# Altium schematic sheet S00-OVERVIEW.SchDoc
size B; SheetNumber: 1; SheetTotal: 7; BLOCK-TITLE: OVERVIEW AND TITLE PAGE; BLOCK-SIZE: B; BLOCK-PROJECT: MULTIMOD BASE; BLOCK-REVISION: 1; BLOCK-ORGANIZATION: UNIVERSITY OF FLORIDA; BLOCK-DESIGNER: MEHRON TALEBI; BLOCK-IDENTIFIER: SUMMER 2023; BLOCK-REVIEWER: MIKE STAPLETON
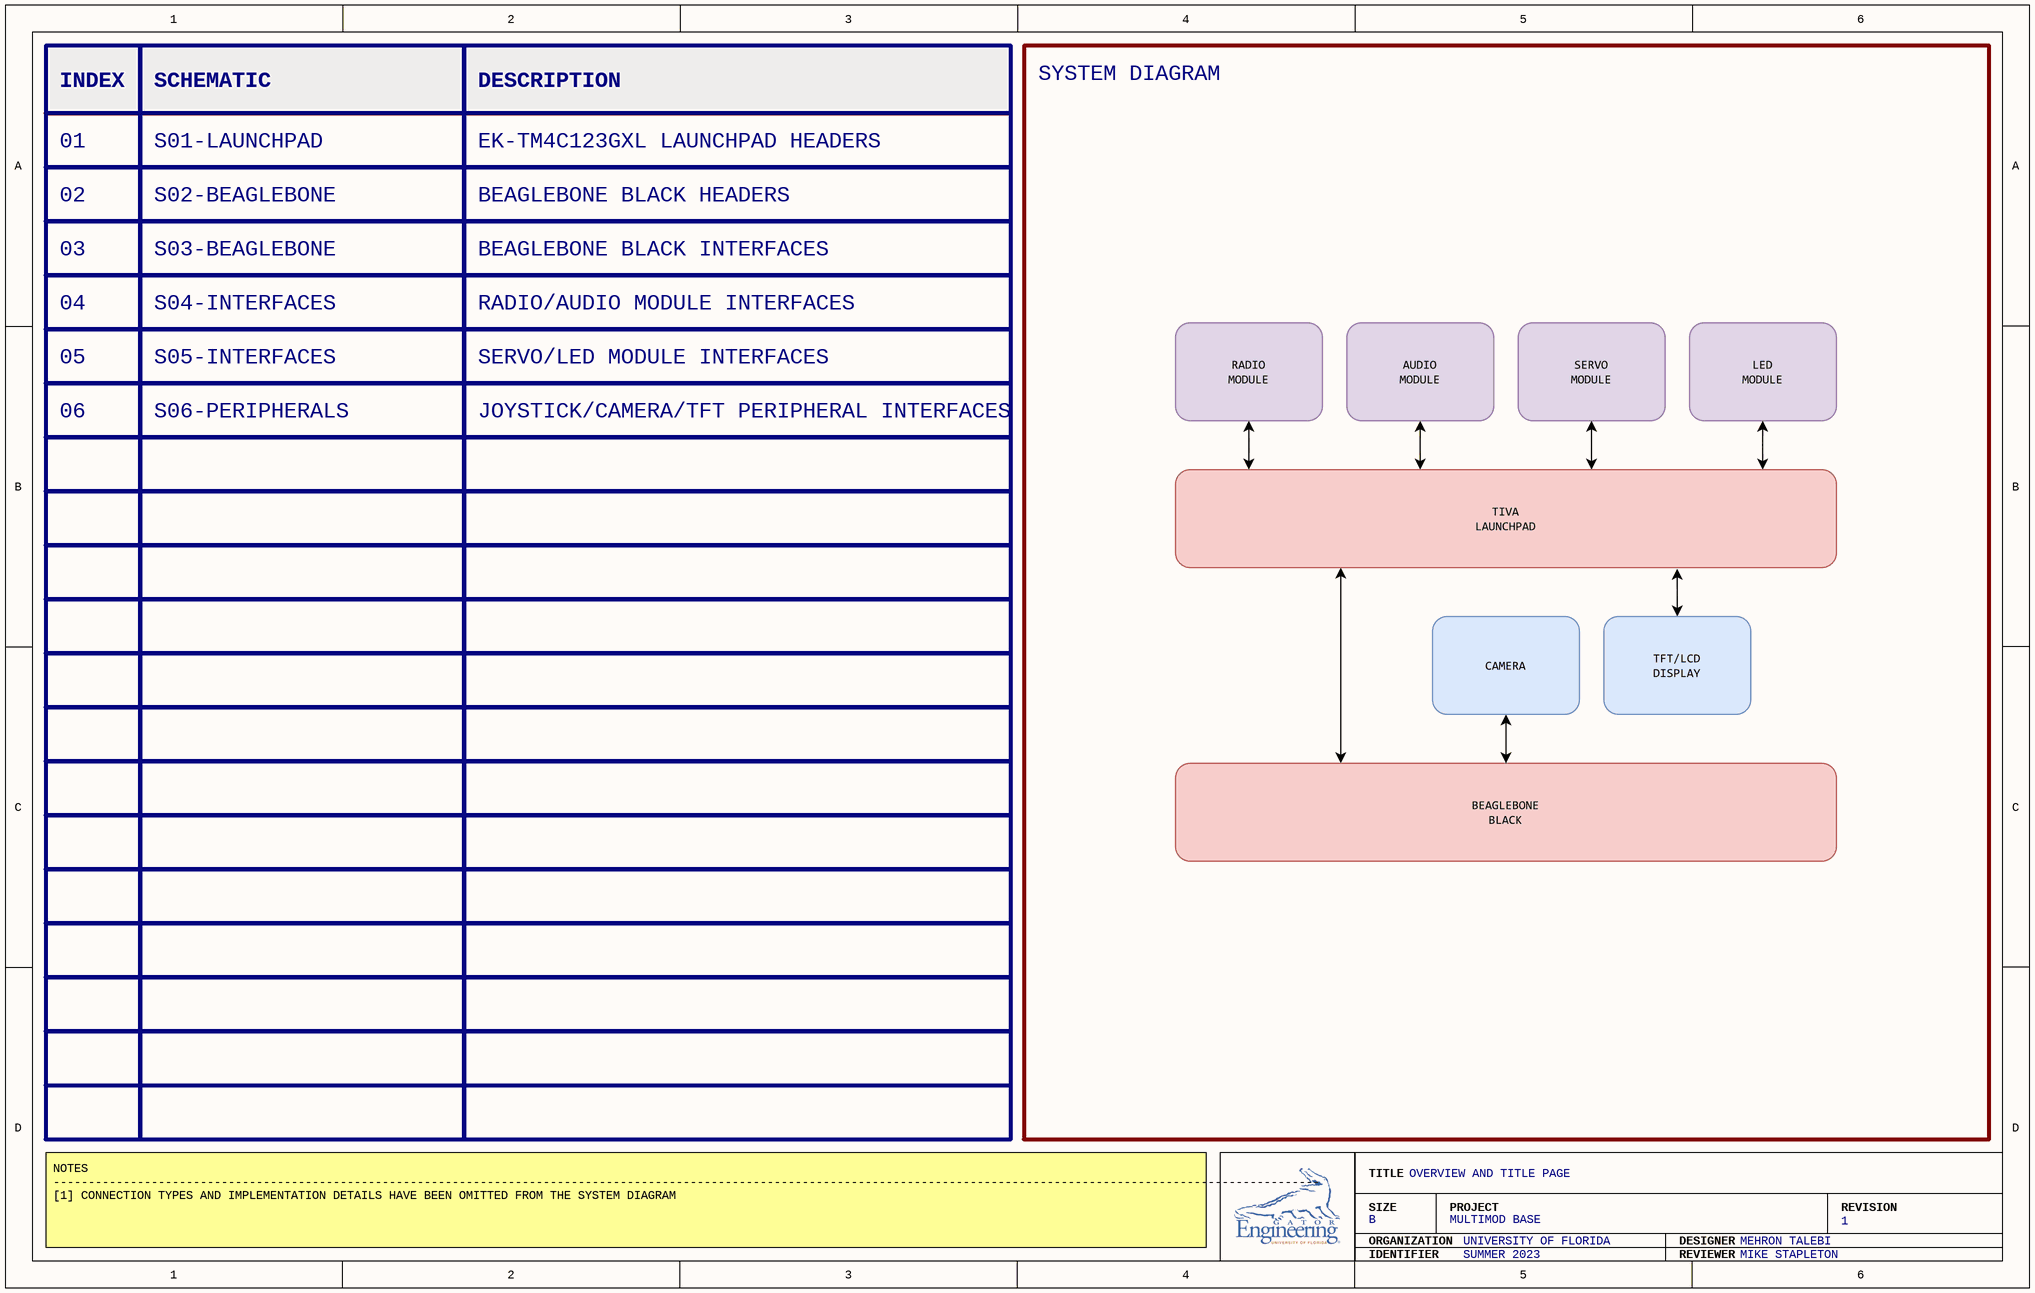
[diagram p0: S00-OVERVIEW.SchDoc]

## Notes on the sheet
- INDEX
- SCHEMATIC
- DESCRIPTION
- SYSTEM DIAGRAM
- 01
- S01-LAUNCHPAD
- EK-TM4C123GXL LAUNCHPAD HEADERS
- 02
- 03
- S02-BEAGLEBONE
- S03-BEAGLEBONE
- BEAGLEBONE BLACK INTERFACES
- BEAGLEBONE BLACK HEADERS
- 04
- S04-INTERFACES
- RADIO/AUDIO MODULE INTERFACES
- 05
- S05-INTERFACES
- SERVO/LED MODULE INTERFACES
- 06
- S06-PERIPHERALS
- JOYSTICK/CAMERA/TFT PERIPHERAL INTERFACES
- NOTES
  -------------------------------------------------------------------------------------------------------------------------------------------------------------------------------------
  [1] CONNECTION TYPES AND IMPLEMENTATION DETAILS HAVE BEEN OMITTED FROM THE SYSTEM DIAGRAM
- TITLE
- SIZE
- ORGANIZATION
- PROJECT
- DESIGNER
- REVISION
- IDENTIFIER
- REVIEWER